# EAGLE design untitled (EAGLE 6.4)
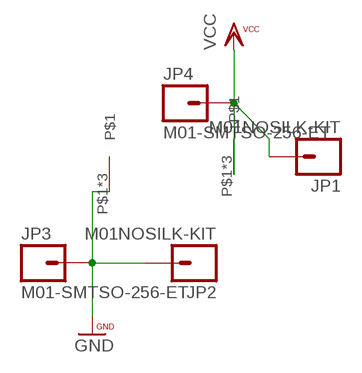
[diagram p0: schematic, sheet 1]

## Parts
JP1  M01NOSILK-KIT  [1X01NS-KIT]
JP2  M01NOSILK-KIT  [1X01NS-KIT]
JP3  M01-SMTSO-256-ET  [SMTSO-256-ET]
JP4  M01-SMTSO-256-ET  [SMTSO-256-ET]
U$1  PANTOGRAPH  [WIREHOLDER]
U$2  PANTOGRAPH  [WIREHOLDER]

## Nets
GND: JP2.1 JP3.P$1 U$1.P$1 U$1.P$2 U$1.P$3
VCC: JP1.1 JP4.P$1 U$2.P$1 U$2.P$2 U$2.P$3

## Library data of the parts
JP1-JP4 = SparkFun-Connectors:M01: Header 1 Standard 1-pin 0.1" header. Use with straight break away headers (SKU : PRT-00116), right angle break away headers (PRT-00553), swiss pins (PRT-00743), machine pins (PRT-00117), and female headers (PRT-00115).
U$1 U$2 = Benchoff:PANTOGRAPH

## Board
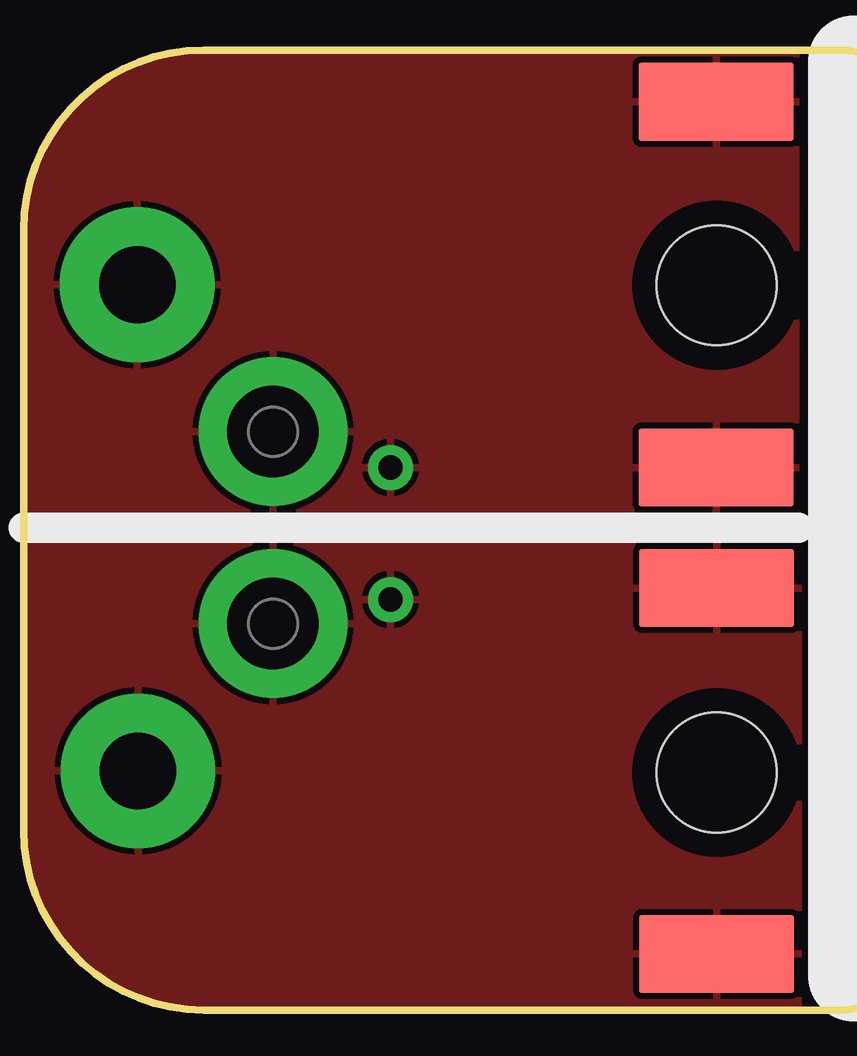
[diagram p1: board, top side]
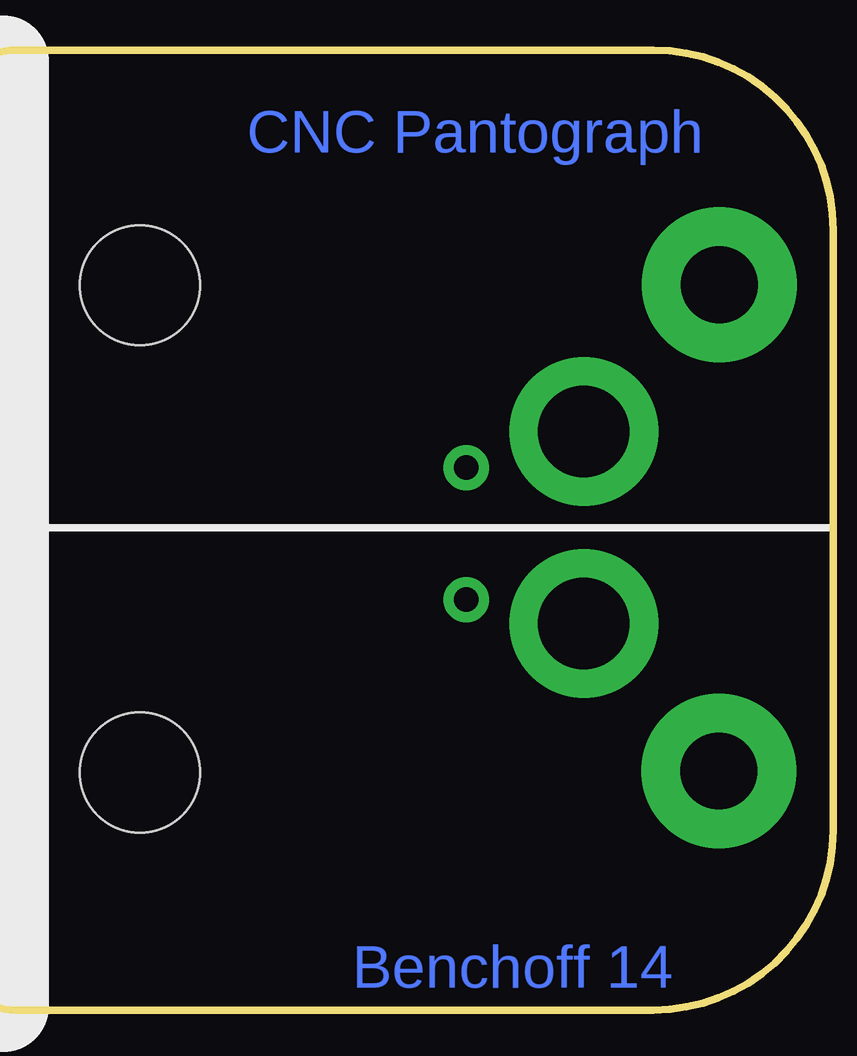
[diagram p2: board, bottom side, seen from below]

No outline drawn. Coordinates in mm, seen from the top.
Copper layers (1*16): Top 0.035mm / dielectric 1.5mm / Bottom 0.035mm
Design rules "default": minimum track width 10mil, minimum drill 24mil, track to track 8mil, track to pad 8mil, pad to pad 8mil, via to via 8mil, smd to smd 8mil, copper to edge 40mil, drill to drill 8mil, minimum pad ring 10mil, minimum via ring 8mil, stop-mask expansion 4mil, vias tented up to drill 0mil, thermal gap 10mil
Holes 5 mm at 48.9,19.9 48.9,40.2
Milling: 9 lines

### Footprints (pad centres in the part's own frame; a part is rotated, then mirrored left to right if it is on the bottom)
1X01NS-KIT = drill 1.016 pad 1.88: 1 0,0
SMTSO-256-ET = drill 3.81 pad 6.198: P$1 0,0
WIREHOLDER = smd 6.452 x 3.251: P$1 8.89,-7.62; P$2 8.89,7.62 | drill 3.2 pad 6.452: P$3 -15.24,0

### Placement (x,y rotation side)
JP1  35.3,32.6 0 top
JP2  35.3,27.1 0 top
JP3  30.4,26.1 0 top
JP4  30.4,34.1 0 top
U$1  40.01,19.96 0 top
U$2  39.98,40.23 0 top

### Tracks (layer width: path | path; a pad name or v marks a point on that pad's centre or on a via)
GND
  pour Top: 52.3,29.4 20,29.4 20,17.5 arc90 27.5,10 52.3,10
VCC
  pour Top: 52.2,30.8 20,30.8 20,40 20,42.5 arc-90 27.5,50 50,50 52.2,50

### Text on the board
Bottom: CNC Pantograph | Benchoff 14
bStop: CNC Pantograph | Benchoff 14